# EAGLE schematic robo_shield (EAGLE 9.5.2)
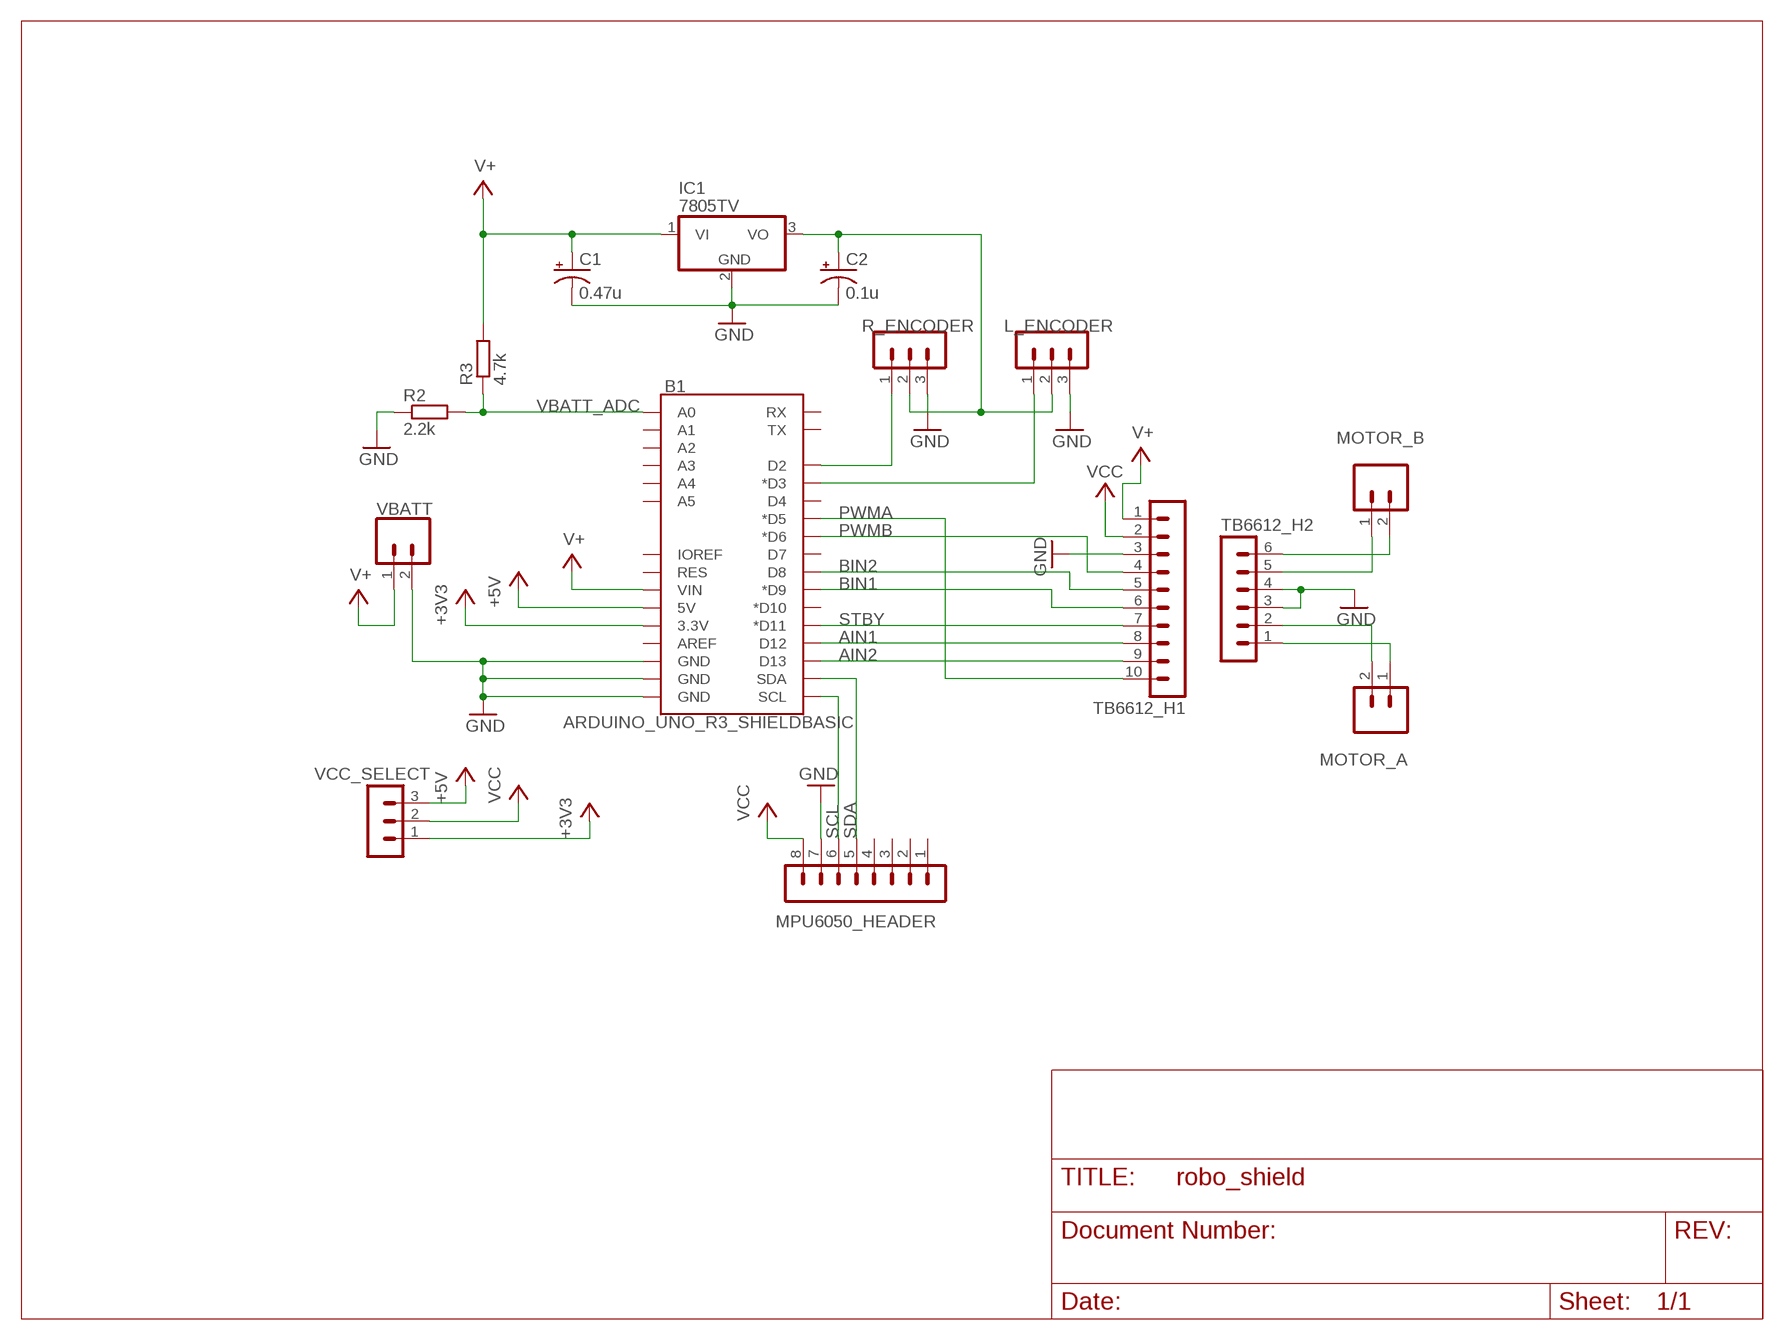
[diagram p0: schematic, sheet 1]

## Parts
B1  ARDUINO_UNO_R3_SHIELDBASIC  [UNO_R3_SHIELD]
C1  0.47u  CPOL-USE5-5  [E5-5]
C2  0.1u  CPOL-USE5-5  [E5-5]
IC1  7805TV  [TO220V]
L_ENCODER  MA03-1  [MA03-1]
MOTOR_A  CONN_025MM  [SCREWTERMINAL-5MM-2]
MOTOR_B  CONN_025MM  [SCREWTERMINAL-5MM-2]
MPU6050_HEADER  MA08-1  [MA08-1]
R2  2.2k  R-EU_0207/10  [0207/10]
R3  4.7k  R-EU_0207/10  [0207/10]
R_ENCODER  MA03-1  [MA03-1]
TB6612_H1  MA10-1  [MA10-1]
TB6612_H2  MA06-1  [MA06-1]
VBATT  CONN_025MM  [SCREWTERMINAL-5MM-2]
VCC_SELECT  MA03-1  [MA03-1]

## Nets
+3V3: B1.3.3V VCC_SELECT.1
+5V: B1.5V VCC_SELECT.3
AIN1: B1.D12 TB6612_H1.8
AIN2: B1.D13 TB6612_H1.9
BIN1: B1.D9(*D9) TB6612_H1.6
BIN2: B1.D8 TB6612_H1.5
GND: B1.GND@0(GND) B1.GND@1(GND) B1.GND@2(GND) C1.- C2.- IC1.2(GND) L_ENCODER.3 MPU6050_HEADER.7 R2.1 R_ENCODER.3 TB6612_H1.3 TB6612_H2.3 TB6612_H2.4 VBATT.2
N$1: B1.D2 R_ENCODER.1
N$2: B1.D3(*D3) L_ENCODER.1
N$3: MOTOR_B.2 TB6612_H2.6
N$4: MOTOR_B.1 TB6612_H2.5
N$5: MOTOR_A.2 TB6612_H2.2
N$6: MOTOR_A.1 TB6612_H2.1
N$7: C2.+ IC1.3(VO) L_ENCODER.2 R_ENCODER.2
PWMA: B1.D5(*D5) TB6612_H1.10
PWMB: B1.D6(*D6) TB6612_H1.4
SCL: B1.SCL MPU6050_HEADER.6
SDA: B1.SDA MPU6050_HEADER.5
STBY: B1.D11(*D11) TB6612_H1.7
V+: B1.VIN C1.+ IC1.1(VI) R3.2 TB6612_H1.1 VBATT.1
VBATT_ADC: B1.A0 R2.2 R3.1
VCC: MPU6050_HEADER.8 TB6612_H1.2 VCC_SELECT.2
Unconnected: B1.A1 B1.A2 B1.A3 B1.A4 B1.A5 B1.AREF B1.D4 B1.D7 B1.D10(*D10) B1.IOREF B1.RES B1.RX B1.TX MPU6050_HEADER.1 MPU6050_HEADER.2 MPU6050_HEADER.3 MPU6050_HEADER.4

## Library data of the parts
B1 = SparkFun-Boards:ARDUINO_UNO_R3_SHIELD: Arduino R3 Shield Footprint Shield form compatible with the Arduino Uno R3. SparkFun Products: MG2639 Cellular Shield <https://www.sparkfun.com/products/13120> MIDI Shield <https://www.sparkfun.com/products/12898> R3 Stackable Headers Kit <https://www.sparkfun.com/products/11417>
C1 C2 = rcl:CPOL-US: POLARIZED CAPACITOR, American symbol; SPICEPREFIX: C
IC1 = linear:78*: Positive VOLTAGE REGULATOR Source: http://cache.national.com/ds/LM/LM78L05.pdf http://www.fairchildsemi.com/ds/LM/LM7805.pdf
L_ENCODER R_ENCODER VCC_SELECT = con-lstb:MA03-1: PIN HEADER; OC_FARNELL: unknown; OC_NEWARK: unknown
MOTOR_A MOTOR_B VBATT = SparkFun-Connectors:CONN_02: Multi connection point. Often used as Generic Header-pin footprint for 0.1 inch spaced/style header connections On any of the 0.1 inch spaced packages, you can populate with these: Break Away Headers - Straight <https://www.sparkfun.com/products/116> (PRT-00116) Break Away Male Headers - Right Angle <https://www.sparkfun.com/products/553> (PRT-00553) Female Headers <https://www.sparkfun.com/products/115> (PRT-00115) Break Away Headers - Machine Pin <https://www.sparkfun.com/products/117> (PRT-00117) Break Away Female Headers - Swiss Machine Pin <https://www.sparkfun.com/products/743> (PRT-00743) For SCREWTERMINALS and SPRING TERMINALS visit here: Screw Terimnals on SparkFun.com <https://www.sparkfun.com/search/results?term=Screw+Terminals> (5mm/3.5mm/2.54mm spacing) This device is also useful as a general connection point to wire up your design to another part of your project. Our various solder wires solder well into these plated through hole pads. Hook-Up Wire - Assortment (Stranded, 22 AWG) <https://www.sparkfun.com/products/11375> (PRT-11375) Hook-Up Wire - Assortment (Solid Core, 22 AWG) <https://www.sparkfun.com/products/11367> (PRT-11367) View the entire wire category on our website here <https://www.sparkfun.com/categories/141> Special notes: Molex polarized connector foot print use with: PRT-08233 with associated crimp pins and housings. 2.54_SCREWTERM for use with PRT-10571. 3.5mm Screw Terminal footprints for PRT-08084 5mm Screw Terminal footprints for use with PRT-08432; SF_SKU: PRT-08432
MPU6050_HEADER = con-lstb:MA08-1: PIN HEADER; OC_FARNELL: unknown; OC_NEWARK: unknown
R2 R3 = rcl:R-EU_: RESISTOR, European symbol; SPICEPREFIX: R
TB6612_H1 = con-lstb:MA10-1: PIN HEADER; OC_FARNELL: unknown; OC_NEWARK: unknown
TB6612_H2 = con-lstb:MA06-1: PIN HEADER; OC_FARNELL: unknown; OC_NEWARK: unknown